# EAGLE schematic AutoPad-R3-RevA (EAGLE 9.5.2), part 3 of 3
## Sheet 11 of 12
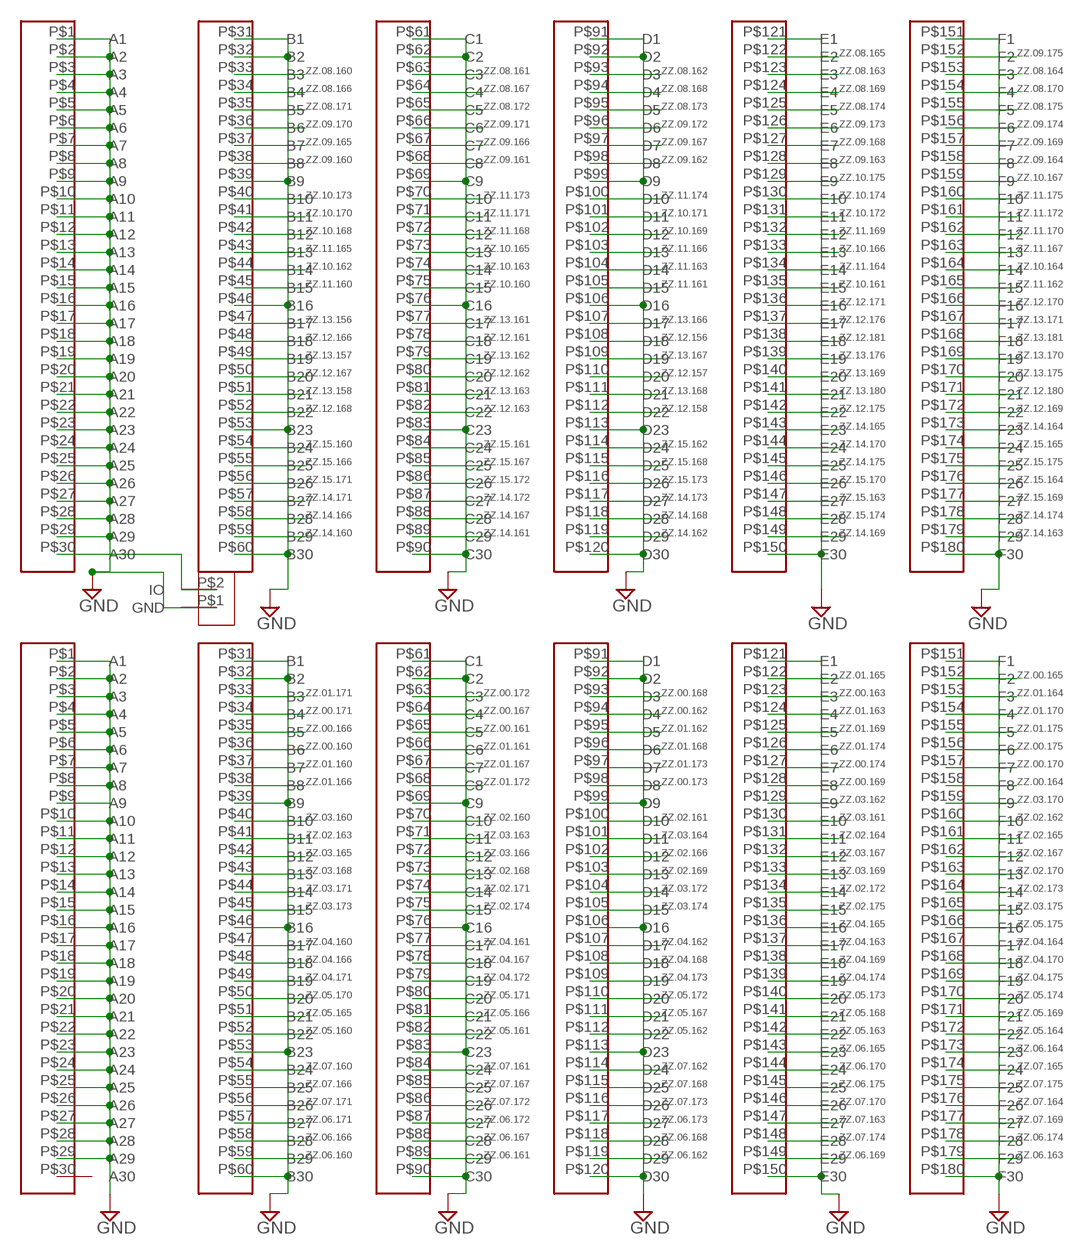
[diagram p10: schematic, sheet 11]

### Parts
U$21  SEAM-30-02.0-L-06-1-A-K-TR  [SEAM-30-02.0-L-06-1-A-K-TR]
U$22  SEAM-30-02.0-L-06-1-A-K-TR  [SEAM-30-02.0-L-06-1-A-K-TR]
U$35  DS2431  [SD2431]

### Nets
GND: U$21.P$1(A1) U$21.P$2(A2) U$21.P$3(A3) U$21.P$4(A4) U$21.P$5(A5) U$21.P$6(A6) U$21.P$7(A7) U$21.P$8(A8) U$21.P$9(A9) U$21.P$10(A10) U$21.P$11(A11) U$21.P$12(A12) U$21.P$13(A13) U$21.P$14(A14) U$21.P$15(A15) U$21.P$16(A16) U$21.P$17(A17) U$21.P$18(A18) U$21.P$19(A19) U$21.P$20(A20) U$21.P$21(A21) U$21.P$22(A22) U$21.P$23(A23) U$21.P$24(A24) U$21.P$25(A25) U$21.P$26(A26) U$21.P$27(A27) U$21.P$28(A28) U$21.P$29(A29) U$21.P$31(B1) U$21.P$32(B2) U$21.P$39(B9) U$21.P$46(B16) U$21.P$53(B23) U$21.P$60(B30) U$21.P$61(C1) U$21.P$62(C2) U$21.P$69(C9) U$21.P$76(C16) U$21.P$83(C23) U$21.P$90(C30) U$21.P$91(D1) U$21.P$92(D2) U$21.P$99(D9) U$21.P$106(D16) U$21.P$113(D23) U$21.P$120(D30) U$21.P$121(E1) U$21.P$150(E30) U$21.P$151(F1) U$21.P$180(F30) U$22.P$1(A1) U$22.P$2(A2) U$22.P$3(A3) U$22.P$4(A4) U$22.P$5(A5) U$22.P$6(A6) U$22.P$7(A7) U$22.P$8(A8) U$22.P$9(A9) U$22.P$10(A10) U$22.P$11(A11) U$22.P$12(A12) U$22.P$13(A13) U$22.P$14(A14) U$22.P$15(A15) U$22.P$16(A16) U$22.P$17(A17) U$22.P$18(A18) U$22.P$19(A19) U$22.P$20(A20) U$22.P$21(A21) U$22.P$22(A22) U$22.P$23(A23) U$22.P$24(A24) U$22.P$25(A25) U$22.P$26(A26) U$22.P$27(A27) U$22.P$28(A28) U$22.P$29(A29) U$22.P$31(B1) U$22.P$32(B2) U$22.P$39(B9) U$22.P$46(B16) U$22.P$53(B23) U$22.P$60(B30) U$22.P$61(C1) U$22.P$62(C2) U$22.P$69(C9) U$22.P$76(C16) U$22.P$83(C23) U$22.P$90(C30) U$22.P$91(D1) U$22.P$92(D2) U$22.P$99(D9) U$22.P$106(D16) U$22.P$113(D23) U$22.P$120(D30) U$22.P$121(E1) U$22.P$150(E30) U$22.P$151(F1) U$22.P$180(F30) U$35.P$1(GND) ; also sheet 1,2,3,4,5,6,7,8,9,10,12
N$11: U$21.P$30(A30) U$35.P$2(IO)
ZZ.00.160: U$22.P$36(B6)
ZZ.00.161: U$22.P$65(C5)
ZZ.00.162: U$22.P$94(D4)
ZZ.00.163: U$22.P$123(E3)
ZZ.00.164: U$22.P$158(F8)
ZZ.00.165: U$22.P$152(F2)
ZZ.00.166: U$22.P$35(B5)
ZZ.00.167: U$22.P$64(C4)
ZZ.00.168: U$22.P$93(D3)
ZZ.00.169: U$22.P$128(E8)
ZZ.00.170: U$22.P$157(F7)
ZZ.00.171: U$22.P$34(B4)
ZZ.00.172: U$22.P$63(C3)
ZZ.00.173: U$22.P$98(D8)
ZZ.00.174: U$22.P$127(E7)
ZZ.00.175: U$22.P$156(F6)
ZZ.01.160: U$22.P$37(B7)
ZZ.01.161: U$22.P$66(C6)
ZZ.01.162: U$22.P$95(D5)
ZZ.01.163: U$22.P$124(E4)
ZZ.01.164: U$22.P$153(F3)
ZZ.01.165: U$22.P$122(E2)
ZZ.01.166: U$22.P$38(B8)
ZZ.01.167: U$22.P$67(C7)
ZZ.01.168: U$22.P$96(D6)
ZZ.01.169: U$22.P$125(E5)
ZZ.01.170: U$22.P$154(F4)
ZZ.01.171: U$22.P$33(B3)
ZZ.01.172: U$22.P$68(C8)
ZZ.01.173: U$22.P$97(D7)
ZZ.01.174: U$22.P$126(E6)
ZZ.01.175: U$22.P$155(F5)
ZZ.02.160: U$22.P$70(C10)
ZZ.02.161: U$22.P$100(D10)
ZZ.02.162: U$22.P$160(F10)
ZZ.02.163: U$22.P$41(B11)
ZZ.02.164: U$22.P$131(E11)
ZZ.02.165: U$22.P$161(F11)
ZZ.02.166: U$22.P$102(D12)
ZZ.02.167: U$22.P$162(F12)
ZZ.02.168: U$22.P$73(C13)
ZZ.02.169: U$22.P$103(D13)
ZZ.02.170: U$22.P$163(F13)
ZZ.02.171: U$22.P$74(C14)
ZZ.02.172: U$22.P$134(E14)
ZZ.02.173: U$22.P$164(F14)
ZZ.02.174: U$22.P$75(C15)
ZZ.02.175: U$22.P$135(E15)
ZZ.03.160: U$22.P$40(B10)
ZZ.03.161: U$22.P$130(E10)
ZZ.03.162: U$22.P$129(E9)
ZZ.03.163: U$22.P$71(C11)
ZZ.03.164: U$22.P$101(D11)
ZZ.03.165: U$22.P$42(B12)
ZZ.03.166: U$22.P$72(C12)
ZZ.03.167: U$22.P$132(E12)
ZZ.03.168: U$22.P$43(B13)
ZZ.03.169: U$22.P$133(E13)
ZZ.03.170: U$22.P$159(F9)
ZZ.03.171: U$22.P$44(B14)
ZZ.03.172: U$22.P$104(D14)
ZZ.03.173: U$22.P$45(B15)
ZZ.03.174: U$22.P$105(D15)
ZZ.03.175: U$22.P$165(F15)
ZZ.04.160: U$22.P$47(B17)
ZZ.04.161: U$22.P$77(C17)
ZZ.04.162: U$22.P$107(D17)
ZZ.04.163: U$22.P$137(E17)
ZZ.04.164: U$22.P$167(F17)
ZZ.04.165: U$22.P$136(E16)
ZZ.04.166: U$22.P$48(B18)
ZZ.04.167: U$22.P$78(C18)
ZZ.04.168: U$22.P$108(D18)
ZZ.04.169: U$22.P$138(E18)
ZZ.04.170: U$22.P$168(F18)
ZZ.04.171: U$22.P$49(B19)
ZZ.04.172: U$22.P$79(C19)
ZZ.04.173: U$22.P$109(D19)
ZZ.04.174: U$22.P$139(E19)
ZZ.04.175: U$22.P$169(F19)
ZZ.05.160: U$22.P$52(B22)
ZZ.05.161: U$22.P$82(C22)
ZZ.05.162: U$22.P$112(D22)
ZZ.05.163: U$22.P$142(E22)
ZZ.05.164: U$22.P$172(F22)
ZZ.05.165: U$22.P$51(B21)
ZZ.05.166: U$22.P$81(C21)
ZZ.05.167: U$22.P$111(D21)
ZZ.05.168: U$22.P$141(E21)
ZZ.05.169: U$22.P$171(F21)
ZZ.05.170: U$22.P$50(B20)
ZZ.05.171: U$22.P$80(C20)
ZZ.05.172: U$22.P$110(D20)
ZZ.05.173: U$22.P$140(E20)
ZZ.05.174: U$22.P$170(F20)
ZZ.05.175: U$22.P$166(F16)
ZZ.06.160: U$22.P$59(B29)
ZZ.06.161: U$22.P$89(C29)
ZZ.06.162: U$22.P$119(D29)
ZZ.06.163: U$22.P$179(F29)
ZZ.06.164: U$22.P$173(F23)
ZZ.06.165: U$22.P$143(E23)
ZZ.06.166: U$22.P$58(B28)
ZZ.06.167: U$22.P$88(C28)
ZZ.06.168: U$22.P$118(D28)
ZZ.06.169: U$22.P$149(E29)
ZZ.06.170: U$22.P$144(E24)
ZZ.06.171: U$22.P$57(B27)
ZZ.06.172: U$22.P$87(C27)
ZZ.06.173: U$22.P$117(D27)
ZZ.06.174: U$22.P$178(F28)
ZZ.06.175: U$22.P$145(E25)
ZZ.07.160: U$22.P$54(B24)
ZZ.07.161: U$22.P$84(C24)
ZZ.07.162: U$22.P$114(D24)
ZZ.07.163: U$22.P$147(E27)
ZZ.07.164: U$22.P$176(F26)
ZZ.07.165: U$22.P$174(F24)
ZZ.07.166: U$22.P$55(B25)
ZZ.07.167: U$22.P$85(C25)
ZZ.07.168: U$22.P$115(D25)
ZZ.07.169: U$22.P$177(F27)
ZZ.07.170: U$22.P$146(E26)
ZZ.07.171: U$22.P$56(B26)
ZZ.07.172: U$22.P$86(C26)
ZZ.07.173: U$22.P$116(D26)
ZZ.07.174: U$22.P$148(E28)
ZZ.07.175: U$22.P$175(F25)
ZZ.08.160: U$21.P$33(B3)
ZZ.08.161: U$21.P$63(C3)
ZZ.08.162: U$21.P$93(D3)
ZZ.08.163: U$21.P$123(E3)
ZZ.08.164: U$21.P$153(F3)
ZZ.08.165: U$21.P$122(E2)
ZZ.08.166: U$21.P$34(B4)
ZZ.08.167: U$21.P$64(C4)
ZZ.08.168: U$21.P$94(D4)
ZZ.08.169: U$21.P$124(E4)
ZZ.08.170: U$21.P$154(F4)
ZZ.08.171: U$21.P$35(B5)
ZZ.08.172: U$21.P$65(C5)
ZZ.08.173: U$21.P$95(D5)
ZZ.08.174: U$21.P$125(E5)
ZZ.08.175: U$21.P$155(F5)
ZZ.09.160: U$21.P$38(B8)
ZZ.09.161: U$21.P$68(C8)
ZZ.09.162: U$21.P$98(D8)
ZZ.09.163: U$21.P$128(E8)
ZZ.09.164: U$21.P$158(F8)
ZZ.09.165: U$21.P$37(B7)
ZZ.09.166: U$21.P$67(C7)
ZZ.09.167: U$21.P$97(D7)
ZZ.09.168: U$21.P$127(E7)
ZZ.09.169: U$21.P$157(F7)
ZZ.09.170: U$21.P$36(B6)
ZZ.09.171: U$21.P$66(C6)
ZZ.09.172: U$21.P$96(D6)
ZZ.09.173: U$21.P$126(E6)
ZZ.09.174: U$21.P$156(F6)
ZZ.09.175: U$21.P$152(F2)
ZZ.10.160: U$21.P$75(C15)
ZZ.10.161: U$21.P$135(E15)
ZZ.10.162: U$21.P$44(B14)
ZZ.10.163: U$21.P$74(C14)
ZZ.10.164: U$21.P$164(F14)
ZZ.10.165: U$21.P$73(C13)
ZZ.10.166: U$21.P$133(E13)
ZZ.10.167: U$21.P$159(F9)
ZZ.10.168: U$21.P$42(B12)
ZZ.10.169: U$21.P$102(D12)
ZZ.10.170: U$21.P$41(B11)
ZZ.10.171: U$21.P$101(D11)
ZZ.10.172: U$21.P$131(E11)
ZZ.10.173: U$21.P$40(B10)
ZZ.10.174: U$21.P$130(E10)
ZZ.10.175: U$21.P$129(E9)
ZZ.11.160: U$21.P$45(B15)
ZZ.11.161: U$21.P$105(D15)
ZZ.11.162: U$21.P$165(F15)
ZZ.11.163: U$21.P$104(D14)
ZZ.11.164: U$21.P$134(E14)
ZZ.11.165: U$21.P$43(B13)
ZZ.11.166: U$21.P$103(D13)
ZZ.11.167: U$21.P$163(F13)
ZZ.11.168: U$21.P$72(C12)
ZZ.11.169: U$21.P$132(E12)
ZZ.11.170: U$21.P$162(F12)
ZZ.11.171: U$21.P$71(C11)
ZZ.11.172: U$21.P$161(F11)
ZZ.11.173: U$21.P$70(C10)
ZZ.11.174: U$21.P$100(D10)
ZZ.11.175: U$21.P$160(F10)
ZZ.12.156: U$21.P$108(D18)
ZZ.12.157: U$21.P$110(D20)
ZZ.12.158: U$21.P$112(D22)
ZZ.12.161: U$21.P$78(C18)
ZZ.12.162: U$21.P$80(C20)
ZZ.12.163: U$21.P$82(C22)
ZZ.12.166: U$21.P$48(B18)
ZZ.12.167: U$21.P$50(B20)
ZZ.12.168: U$21.P$52(B22)
ZZ.12.169: U$21.P$172(F22)
ZZ.12.170: U$21.P$166(F16)
ZZ.12.171: U$21.P$136(E16)
ZZ.12.175: U$21.P$142(E22)
ZZ.12.176: U$21.P$137(E17)
ZZ.12.180: U$21.P$171(F21)
ZZ.12.181: U$21.P$138(E18)
ZZ.13.156: U$21.P$47(B17)
ZZ.13.157: U$21.P$49(B19)
ZZ.13.158: U$21.P$51(B21)
ZZ.13.161: U$21.P$77(C17)
ZZ.13.162: U$21.P$79(C19)
ZZ.13.163: U$21.P$81(C21)
ZZ.13.166: U$21.P$107(D17)
ZZ.13.167: U$21.P$109(D19)
ZZ.13.168: U$21.P$111(D21)
ZZ.13.169: U$21.P$140(E20)
ZZ.13.170: U$21.P$169(F19)
ZZ.13.171: U$21.P$167(F17)
ZZ.13.175: U$21.P$170(F20)
ZZ.13.176: U$21.P$139(E19)
ZZ.13.180: U$21.P$141(E21)
ZZ.13.181: U$21.P$168(F18)
ZZ.14.160: U$21.P$59(B29)
ZZ.14.161: U$21.P$89(C29)
ZZ.14.162: U$21.P$119(D29)
ZZ.14.163: U$21.P$179(F29)
ZZ.14.164: U$21.P$173(F23)
ZZ.14.165: U$21.P$143(E23)
ZZ.14.166: U$21.P$58(B28)
ZZ.14.167: U$21.P$88(C28)
ZZ.14.168: U$21.P$118(D28)
ZZ.14.169: U$21.P$149(E29)
ZZ.14.170: U$21.P$144(E24)
ZZ.14.171: U$21.P$57(B27)
ZZ.14.172: U$21.P$87(C27)
ZZ.14.173: U$21.P$117(D27)
ZZ.14.174: U$21.P$178(F28)
ZZ.14.175: U$21.P$145(E25)
ZZ.15.160: U$21.P$54(B24)
ZZ.15.161: U$21.P$84(C24)
ZZ.15.162: U$21.P$114(D24)
ZZ.15.163: U$21.P$147(E27)
ZZ.15.164: U$21.P$176(F26)
ZZ.15.165: U$21.P$174(F24)
ZZ.15.166: U$21.P$55(B25)
ZZ.15.167: U$21.P$85(C25)
ZZ.15.168: U$21.P$115(D25)
ZZ.15.169: U$21.P$177(F27)
ZZ.15.170: U$21.P$146(E26)
ZZ.15.171: U$21.P$56(B26)
ZZ.15.172: U$21.P$86(C26)
ZZ.15.173: U$21.P$116(D26)
ZZ.15.174: U$21.P$148(E28)
ZZ.15.175: U$21.P$175(F25)
Unconnected: U$22.P$30(A30)

## Sheet 12 of 12
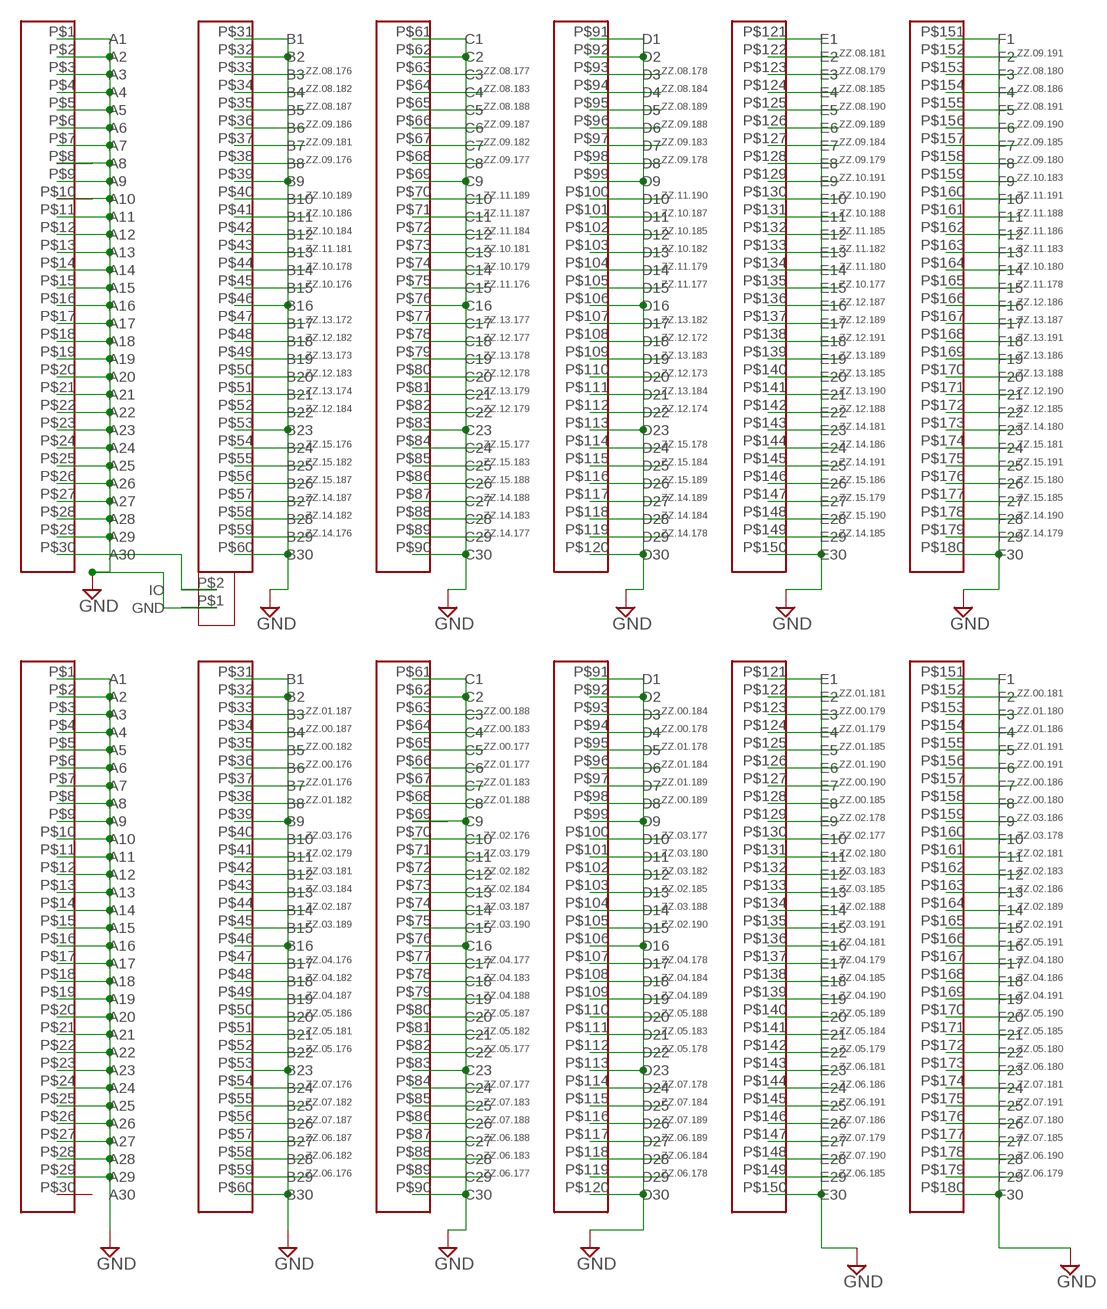
[diagram p11: schematic, sheet 12]

### Parts
U$23  SEAM-30-02.0-L-06-1-A-K-TR  [SEAM-30-02.0-L-06-1-A-K-TR]
U$24  SEAM-30-02.0-L-06-1-A-K-TR  [SEAM-30-02.0-L-06-1-A-K-TR]
U$36  DS2431  [SD2431]

### Nets
GND: U$23.P$1(A1) U$23.P$2(A2) U$23.P$3(A3) U$23.P$4(A4) U$23.P$5(A5) U$23.P$6(A6) U$23.P$7(A7) U$23.P$8(A8) U$23.P$9(A9) U$23.P$10(A10) U$23.P$11(A11) U$23.P$12(A12) U$23.P$13(A13) U$23.P$14(A14) U$23.P$15(A15) U$23.P$16(A16) U$23.P$17(A17) U$23.P$18(A18) U$23.P$19(A19) U$23.P$20(A20) U$23.P$21(A21) U$23.P$22(A22) U$23.P$23(A23) U$23.P$24(A24) U$23.P$25(A25) U$23.P$26(A26) U$23.P$27(A27) U$23.P$28(A28) U$23.P$29(A29) U$23.P$31(B1) U$23.P$32(B2) U$23.P$39(B9) U$23.P$46(B16) U$23.P$53(B23) U$23.P$60(B30) U$23.P$61(C1) U$23.P$62(C2) U$23.P$69(C9) U$23.P$76(C16) U$23.P$83(C23) U$23.P$90(C30) U$23.P$91(D1) U$23.P$92(D2) U$23.P$99(D9) U$23.P$106(D16) U$23.P$113(D23) U$23.P$120(D30) U$23.P$121(E1) U$23.P$150(E30) U$23.P$151(F1) U$23.P$180(F30) U$24.P$1(A1) U$24.P$2(A2) U$24.P$3(A3) U$24.P$4(A4) U$24.P$5(A5) U$24.P$6(A6) U$24.P$7(A7) U$24.P$8(A8) U$24.P$9(A9) U$24.P$10(A10) U$24.P$11(A11) U$24.P$12(A12) U$24.P$13(A13) U$24.P$14(A14) U$24.P$15(A15) U$24.P$16(A16) U$24.P$17(A17) U$24.P$18(A18) U$24.P$19(A19) U$24.P$20(A20) U$24.P$21(A21) U$24.P$22(A22) U$24.P$23(A23) U$24.P$24(A24) U$24.P$25(A25) U$24.P$26(A26) U$24.P$27(A27) U$24.P$28(A28) U$24.P$29(A29) U$24.P$31(B1) U$24.P$32(B2) U$24.P$39(B9) U$24.P$46(B16) U$24.P$53(B23) U$24.P$60(B30) U$24.P$61(C1) U$24.P$62(C2) U$24.P$69(C9) U$24.P$76(C16) U$24.P$83(C23) U$24.P$90(C30) U$24.P$91(D1) U$24.P$92(D2) U$24.P$99(D9) U$24.P$106(D16) U$24.P$113(D23) U$24.P$120(D30) U$24.P$121(E1) U$24.P$150(E30) U$24.P$151(F1) U$24.P$180(F30) U$36.P$1(GND) ; also sheet 1,2,3,4,5,6,7,8,9,10,11
N$12: U$23.P$30(A30) U$36.P$2(IO)
ZZ.00.176: U$24.P$36(B6)
ZZ.00.177: U$24.P$65(C5)
ZZ.00.178: U$24.P$94(D4)
ZZ.00.179: U$24.P$123(E3)
ZZ.00.180: U$24.P$158(F8)
ZZ.00.181: U$24.P$152(F2)
ZZ.00.182: U$24.P$35(B5)
ZZ.00.183: U$24.P$64(C4)
ZZ.00.184: U$24.P$93(D3)
ZZ.00.185: U$24.P$128(E8)
ZZ.00.186: U$24.P$157(F7)
ZZ.00.187: U$24.P$34(B4)
ZZ.00.188: U$24.P$63(C3)
ZZ.00.189: U$24.P$98(D8)
ZZ.00.190: U$24.P$127(E7)
ZZ.00.191: U$24.P$156(F6)
ZZ.01.176: U$24.P$37(B7)
ZZ.01.177: U$24.P$66(C6)
ZZ.01.178: U$24.P$95(D5)
ZZ.01.179: U$24.P$124(E4)
ZZ.01.180: U$24.P$153(F3)
ZZ.01.181: U$24.P$122(E2)
ZZ.01.182: U$24.P$38(B8)
ZZ.01.183: U$24.P$67(C7)
ZZ.01.184: U$24.P$96(D6)
ZZ.01.185: U$24.P$125(E5)
ZZ.01.186: U$24.P$154(F4)
ZZ.01.187: U$24.P$33(B3)
ZZ.01.188: U$24.P$68(C8)
ZZ.01.189: U$24.P$97(D7)
ZZ.01.190: U$24.P$126(E6)
ZZ.01.191: U$24.P$155(F5)
ZZ.02.176: U$24.P$70(C10)
ZZ.02.177: U$24.P$130(E10)
ZZ.02.178: U$24.P$129(E9)
ZZ.02.179: U$24.P$41(B11)
ZZ.02.180: U$24.P$131(E11)
ZZ.02.181: U$24.P$161(F11)
ZZ.02.182: U$24.P$72(C12)
ZZ.02.183: U$24.P$162(F12)
ZZ.02.184: U$24.P$73(C13)
ZZ.02.185: U$24.P$103(D13)
ZZ.02.186: U$24.P$163(F13)
ZZ.02.187: U$24.P$44(B14)
ZZ.02.188: U$24.P$134(E14)
ZZ.02.189: U$24.P$164(F14)
ZZ.02.190: U$24.P$105(D15)
ZZ.02.191: U$24.P$165(F15)
ZZ.03.176: U$24.P$40(B10)
ZZ.03.177: U$24.P$100(D10)
ZZ.03.178: U$24.P$160(F10)
ZZ.03.179: U$24.P$71(C11)
ZZ.03.180: U$24.P$101(D11)
ZZ.03.181: U$24.P$42(B12)
ZZ.03.182: U$24.P$102(D12)
ZZ.03.183: U$24.P$132(E12)
ZZ.03.184: U$24.P$43(B13)
ZZ.03.185: U$24.P$133(E13)
ZZ.03.186: U$24.P$159(F9)
ZZ.03.187: U$24.P$74(C14)
ZZ.03.188: U$24.P$104(D14)
ZZ.03.189: U$24.P$45(B15)
ZZ.03.190: U$24.P$75(C15)
ZZ.03.191: U$24.P$135(E15)
ZZ.04.176: U$24.P$47(B17)
ZZ.04.177: U$24.P$77(C17)
ZZ.04.178: U$24.P$107(D17)
ZZ.04.179: U$24.P$137(E17)
ZZ.04.180: U$24.P$167(F17)
ZZ.04.181: U$24.P$136(E16)
ZZ.04.182: U$24.P$48(B18)
ZZ.04.183: U$24.P$78(C18)
ZZ.04.184: U$24.P$108(D18)
ZZ.04.185: U$24.P$138(E18)
ZZ.04.186: U$24.P$168(F18)
ZZ.04.187: U$24.P$49(B19)
ZZ.04.188: U$24.P$79(C19)
ZZ.04.189: U$24.P$109(D19)
ZZ.04.190: U$24.P$139(E19)
ZZ.04.191: U$24.P$169(F19)
ZZ.05.176: U$24.P$52(B22)
ZZ.05.177: U$24.P$82(C22)
ZZ.05.178: U$24.P$112(D22)
ZZ.05.179: U$24.P$142(E22)
ZZ.05.180: U$24.P$172(F22)
ZZ.05.181: U$24.P$51(B21)
ZZ.05.182: U$24.P$81(C21)
ZZ.05.183: U$24.P$111(D21)
ZZ.05.184: U$24.P$141(E21)
ZZ.05.185: U$24.P$171(F21)
ZZ.05.186: U$24.P$50(B20)
ZZ.05.187: U$24.P$80(C20)
ZZ.05.188: U$24.P$110(D20)
ZZ.05.189: U$24.P$140(E20)
ZZ.05.190: U$24.P$170(F20)
ZZ.05.191: U$24.P$166(F16)
ZZ.06.176: U$24.P$59(B29)
ZZ.06.177: U$24.P$89(C29)
ZZ.06.178: U$24.P$119(D29)
ZZ.06.179: U$24.P$179(F29)
ZZ.06.180: U$24.P$173(F23)
ZZ.06.181: U$24.P$143(E23)
ZZ.06.182: U$24.P$58(B28)
ZZ.06.183: U$24.P$88(C28)
ZZ.06.184: U$24.P$118(D28)
ZZ.06.185: U$24.P$149(E29)
ZZ.06.186: U$24.P$144(E24)
ZZ.06.187: U$24.P$57(B27)
ZZ.06.188: U$24.P$87(C27)
ZZ.06.189: U$24.P$117(D27)
ZZ.06.190: U$24.P$178(F28)
ZZ.06.191: U$24.P$145(E25)
ZZ.07.176: U$24.P$54(B24)
ZZ.07.177: U$24.P$84(C24)
ZZ.07.178: U$24.P$114(D24)
ZZ.07.179: U$24.P$147(E27)
ZZ.07.180: U$24.P$176(F26)
ZZ.07.181: U$24.P$174(F24)
ZZ.07.182: U$24.P$55(B25)
ZZ.07.183: U$24.P$85(C25)
ZZ.07.184: U$24.P$115(D25)
ZZ.07.185: U$24.P$177(F27)
ZZ.07.186: U$24.P$146(E26)
ZZ.07.187: U$24.P$56(B26)
ZZ.07.188: U$24.P$86(C26)
ZZ.07.189: U$24.P$116(D26)
ZZ.07.190: U$24.P$148(E28)
ZZ.07.191: U$24.P$175(F25)
ZZ.08.176: U$23.P$33(B3)
ZZ.08.177: U$23.P$63(C3)
ZZ.08.178: U$23.P$93(D3)
ZZ.08.179: U$23.P$123(E3)
ZZ.08.180: U$23.P$153(F3)
ZZ.08.181: U$23.P$122(E2)
ZZ.08.182: U$23.P$34(B4)
ZZ.08.183: U$23.P$64(C4)
ZZ.08.184: U$23.P$94(D4)
ZZ.08.185: U$23.P$124(E4)
ZZ.08.186: U$23.P$154(F4)
ZZ.08.187: U$23.P$35(B5)
ZZ.08.188: U$23.P$65(C5)
ZZ.08.189: U$23.P$95(D5)
ZZ.08.190: U$23.P$125(E5)
ZZ.08.191: U$23.P$155(F5)
ZZ.09.176: U$23.P$38(B8)
ZZ.09.177: U$23.P$68(C8)
ZZ.09.178: U$23.P$98(D8)
ZZ.09.179: U$23.P$128(E8)
ZZ.09.180: U$23.P$158(F8)
ZZ.09.181: U$23.P$37(B7)
ZZ.09.182: U$23.P$67(C7)
ZZ.09.183: U$23.P$97(D7)
ZZ.09.184: U$23.P$127(E7)
ZZ.09.185: U$23.P$157(F7)
ZZ.09.186: U$23.P$36(B6)
ZZ.09.187: U$23.P$66(C6)
ZZ.09.188: U$23.P$96(D6)
ZZ.09.189: U$23.P$126(E6)
ZZ.09.190: U$23.P$156(F6)
ZZ.09.191: U$23.P$152(F2)
ZZ.10.176: U$23.P$45(B15)
ZZ.10.177: U$23.P$135(E15)
ZZ.10.178: U$23.P$44(B14)
ZZ.10.179: U$23.P$74(C14)
ZZ.10.180: U$23.P$164(F14)
ZZ.10.181: U$23.P$73(C13)
ZZ.10.182: U$23.P$103(D13)
ZZ.10.183: U$23.P$159(F9)
ZZ.10.184: U$23.P$42(B12)
ZZ.10.185: U$23.P$102(D12)
ZZ.10.186: U$23.P$41(B11)
ZZ.10.187: U$23.P$101(D11)
ZZ.10.188: U$23.P$131(E11)
ZZ.10.189: U$23.P$40(B10)
ZZ.10.190: U$23.P$130(E10)
ZZ.10.191: U$23.P$129(E9)
ZZ.11.176: U$23.P$75(C15)
ZZ.11.177: U$23.P$105(D15)
ZZ.11.178: U$23.P$165(F15)
ZZ.11.179: U$23.P$104(D14)
ZZ.11.180: U$23.P$134(E14)
ZZ.11.181: U$23.P$43(B13)
ZZ.11.182: U$23.P$133(E13)
ZZ.11.183: U$23.P$163(F13)
ZZ.11.184: U$23.P$72(C12)
ZZ.11.185: U$23.P$132(E12)
ZZ.11.186: U$23.P$162(F12)
ZZ.11.187: U$23.P$71(C11)
ZZ.11.188: U$23.P$161(F11)
ZZ.11.189: U$23.P$70(C10)
ZZ.11.190: U$23.P$100(D10)
ZZ.11.191: U$23.P$160(F10)
ZZ.12.172: U$23.P$108(D18)
ZZ.12.173: U$23.P$110(D20)
ZZ.12.174: U$23.P$112(D22)
ZZ.12.177: U$23.P$78(C18)
ZZ.12.178: U$23.P$80(C20)
ZZ.12.179: U$23.P$82(C22)
ZZ.12.182: U$23.P$48(B18)
ZZ.12.183: U$23.P$50(B20)
ZZ.12.184: U$23.P$52(B22)
ZZ.12.185: U$23.P$172(F22)
ZZ.12.186: U$23.P$166(F16)
ZZ.12.187: U$23.P$136(E16)
ZZ.12.188: U$23.P$142(E22)
ZZ.12.189: U$23.P$137(E17)
ZZ.12.190: U$23.P$171(F21)
ZZ.12.191: U$23.P$138(E18)
ZZ.13.172: U$23.P$47(B17)
ZZ.13.173: U$23.P$49(B19)
ZZ.13.174: U$23.P$51(B21)
ZZ.13.177: U$23.P$77(C17)
ZZ.13.178: U$23.P$79(C19)
ZZ.13.179: U$23.P$81(C21)
ZZ.13.182: U$23.P$107(D17)
ZZ.13.183: U$23.P$109(D19)
ZZ.13.184: U$23.P$111(D21)
ZZ.13.185: U$23.P$140(E20)
ZZ.13.186: U$23.P$169(F19)
ZZ.13.187: U$23.P$167(F17)
ZZ.13.188: U$23.P$170(F20)
ZZ.13.189: U$23.P$139(E19)
ZZ.13.190: U$23.P$141(E21)
ZZ.13.191: U$23.P$168(F18)
ZZ.14.176: U$23.P$59(B29)
ZZ.14.177: U$23.P$89(C29)
ZZ.14.178: U$23.P$119(D29)
ZZ.14.179: U$23.P$179(F29)
ZZ.14.180: U$23.P$173(F23)
ZZ.14.181: U$23.P$143(E23)
ZZ.14.182: U$23.P$58(B28)
ZZ.14.183: U$23.P$88(C28)
ZZ.14.184: U$23.P$118(D28)
ZZ.14.185: U$23.P$149(E29)
ZZ.14.186: U$23.P$144(E24)
ZZ.14.187: U$23.P$57(B27)
ZZ.14.188: U$23.P$87(C27)
ZZ.14.189: U$23.P$117(D27)
ZZ.14.190: U$23.P$178(F28)
ZZ.14.191: U$23.P$145(E25)
ZZ.15.176: U$23.P$54(B24)
ZZ.15.177: U$23.P$84(C24)
ZZ.15.178: U$23.P$114(D24)
ZZ.15.179: U$23.P$147(E27)
ZZ.15.180: U$23.P$176(F26)
ZZ.15.181: U$23.P$174(F24)
ZZ.15.182: U$23.P$55(B25)
ZZ.15.183: U$23.P$85(C25)
ZZ.15.184: U$23.P$115(D25)
ZZ.15.185: U$23.P$177(F27)
ZZ.15.186: U$23.P$146(E26)
ZZ.15.187: U$23.P$56(B26)
ZZ.15.188: U$23.P$86(C26)
ZZ.15.189: U$23.P$116(D26)
ZZ.15.190: U$23.P$148(E28)
ZZ.15.191: U$23.P$175(F25)
Unconnected: U$24.P$30(A30)

## Library data of the parts
U$1-U$24 = SEAM-30-02.0-L-06-1-A-K-TR-offset-origin:SEAM-30-02.0-L-06-1-A-K-TR
U$25-U$36 = DS2431-Hemmick:DS2431